# Altium schematic sheet IO and Connectors.SchDoc
size Letter; DocumentNumber: 6; SheetNumber: 6; SheetTotal: 7
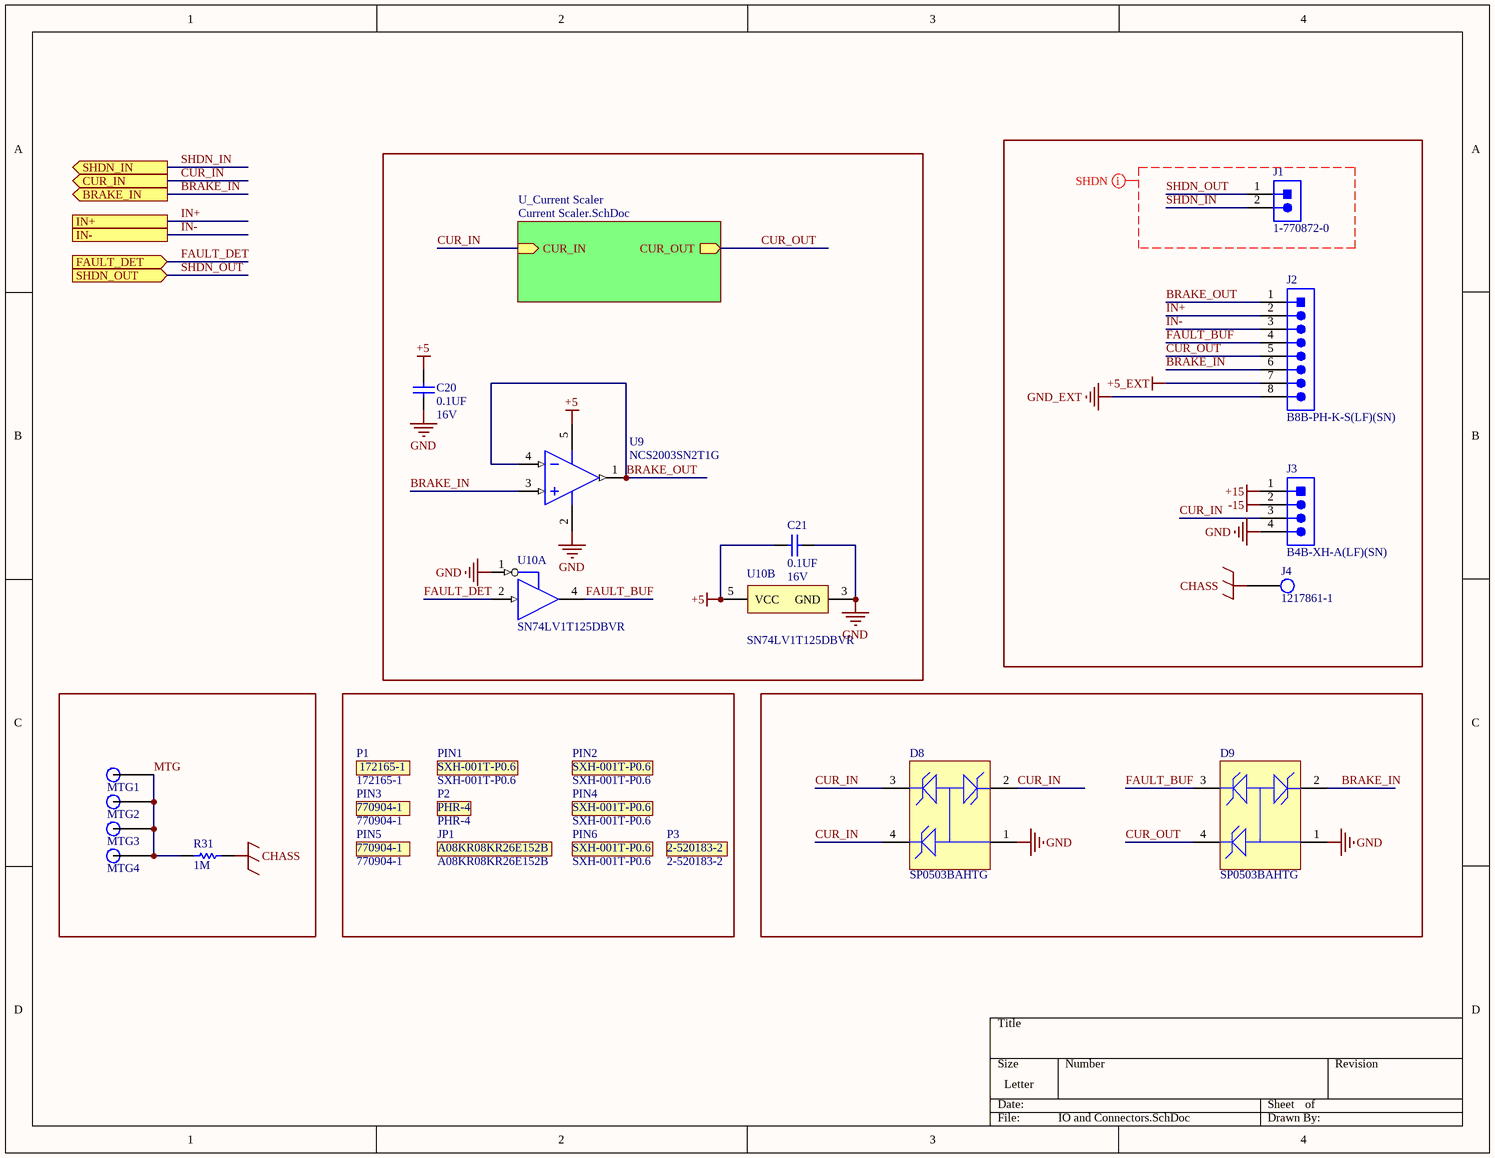
[diagram p0: IO and Connectors.SchDoc]

## Parts
C20  Val: 0.1UF  Vol: 16V  [0603_CAP]  (hidden comment: CAP 0603 0.1UF 16V 10% X7R)
C21  Val: 0.1UF  Vol: 16V  [0603_CAP]  (hidden comment: CAP 0603 0.1UF 16V 10% X7R)
D8  SP0503BAHTG  [LFUS-SOT143-4_V]
D9  SP0503BAHTG  [LFUS-SOT143-4_V]
J1  1-770872-0  [CON2_1X2_P163_VM_ALT]
J2  B8B-PH-K-S(LF)(SN)  [B8B-PH-K]
J3  B4B-XH-A(LF)(SN)  [B4B-XH-A(LF)(SN)]
J4  1217861-1  [1217861-1]
JP1  A08KR08KR26E152B  (mechanical)
MTG1  PCB MTG M3  [MTG-M3]  (value not drawn)  (no BOM)
MTG2  PCB MTG M3  [MTG-M3]  (value not drawn)  (no BOM)
MTG3  PCB MTG M3  [MTG-M3]  (value not drawn)  (no BOM)
MTG4  PCB MTG M3  [MTG-M3]  (value not drawn)  (no BOM)
P1  172165-1  (mechanical)
P2  PHR-4  (mechanical)
P3  2-520183-2  (mechanical)
PIN1  SXH-001T-P0.6  (mechanical)
PIN2  SXH-001T-P0.6  (mechanical)
PIN3  770904-1  (mechanical)
PIN4  SXH-001T-P0.6  (mechanical)
PIN5  770904-1  (mechanical)
PIN6  SXH-001T-P0.6  (mechanical)
R31  value 1M  [RESC2013X60X35ML10T20]  (hidden comment: RT0805BRE071ML)
U9  NCS2003SN2T1G  [ONSC-TSOP-5-483-02_V]
U10  SN74LV1T125DBVR  [DBV0005A_M]  (parts A,B of 2)

## Sub-sheets
U_Current Scaler = Current Scaler.SchDoc: CUR_IN (in), CUR_OUT (out)

## Ports
BRAKE_IN (out), CUR_IN (out), FAULT_DET (in), IN+, IN-, SHDN_IN (out), SHDN_OUT (in)

## Nets
+5: C20.2 C21.2 U9.5(VDD) U10.5(VCC)
+5_EXT: J2.7
+15: J3.1
-15: J3.2
CHASS: J4.1 R31.1
GND: C20.1 C21.1 D8.1 D9.1 J3.4 U9.2(VSS) U10.1(~{OE}) U10.3(GND)
GND_EXT: J2.8
BRAKE_IN: D9.2 J2.6 U9.3(IN+) ; port BRAKE_IN
BRAKE_OUT: J2.1 U9.1(VOUT) U9.4(IN-)
CUR_IN: D8.2 D8.3 D8.4 J3.3 ; port CUR_IN, sheet U_Current Scaler/CUR_IN
CUR_OUT: D9.4 J2.5 ; sheet U_Current Scaler/CUR_OUT
FAULT_BUF: D9.3 J2.4 U10.4(Y)
FAULT_DET: U10.2(A) ; port FAULT_DET
IN+: J2.2 ; port IN+
IN-: J2.3 ; port IN-
MTG: MTG1.1 MTG2.1 MTG3.1 MTG4.1 R31.2
SHDN_IN: J1.2 ; port SHDN_IN
SHDN_OUT: J1.1 ; port SHDN_OUT

## Layout directives
net class PWR; net class HC: SHDN_IN, SHDN_OUT

## Library data of the parts
C20 C21 = CAP 0603 0.1UF 16V 10% X7R: Capacitor Surface Mount 0603 Footprint 0.1UF 16V 10% Tolerance Ceramic X7R; Manufacturer: Various; PCB Package: 0603; Description in Visual: Cap SMT 0603 0.1UF 16V 10%  Cer X7R; P/N: CAP 0603 0.1UF 16V 10% X7R; Manufacturer P/N: Various; Value: 0.1UF; Voltage: 16V; Tolerance: 10%; Type: Ceramic X7R; ComponentLink1Description: Manufacturer Website; ComponentLink2Description: Component Datasheet; ComponentLink3Description: Octopart Link
D8 D9 = CMP-2000-05191-1: TVS Diode Array, 30 pF, 30 KV, -40 to 85 degC, 4-Pin SOT143, RoHS, Tape and Reel; Manufacturer: Littelfuse; Direction Type: Uni-Directional; Product Height (mm): 1.05mm; Leakage Current (Max): 0.1uA; Clamping Voltage (Max): 8V; Reverse Stand-off Voltage: 5.5(Min)V; Configuration: Triple; Working Voltage: 5.5V; Product Length (mm): 3.04mm; Working Voltage (Max): 5.5V(Min); Capacitance Value: 30pF; Rad Hardened: No; Number of Elements: 3; Product Depth (mm): 1.4mm; Operating Temperature Max Deg. C: 85C; Suppressor Type: TVS; Operating Temperature Min Deg. C: -40C; Operating Temp Range: -40Cto85C; Mounting: SurfaceMount; Package / Case: SOT-143; Datasheet Version: Dec-13; Package Type: SOT-143; Packaging: TapeandReel; Pin Count: 3+Tab; Operating Temperature Classification: Industrial; Datasheet URL: https://datasheet.ciiva.com/15143/getdatasheetpartid-116020-15143550.pdf; Manufacturer URL: http://www.littelfuse.com/; Leakage Current: 0.1uA; Mounting Style: SurfaceMount; Clamping Voltage: 8V; Polarity: Uni-Directional
J1 = 1-770872-0: Connector Header Through Hole 2 position 0.163" (4.14mm); Vendor: TE Connectivity; Built_By: EMA_UL_Team; Manufacturer_Part_Number: 1-770872-0; Copyright: Copyright (C) 2018 Accelerated Designs. All rights reserved; RefDes: RefDes; Type: DEV; Value: Value
J2 = B8B-PH-K-S(LF)(SN): Connector Header Through Hole 8 position 0.079" (2.00mm); Supplier 1: Digi-Key; Supplier Part Number 1: 455-1710-ND
J3 = B4B-XH-A(LF)(SN): Connector Header Through Hole 4 position 0.098" (2.50mm); Manufacturer: JST; No of Positions: 4; Style/Orientation: StraightHeader/Plug; Type: ShroudedHeader; Manufacturer URL: http://www.jst.com/home2.html; Termination: Crimp; Datasheet Version: Apr-09; Supplier 1: Newark; Supplier Part Number 1: 73M9436
J4 = 1217861-1: CONN TAB .250 STR QC TIN PCB; Gender: Male; Hole Diameter: 0.055inch; Insulation: Non-Insulated; Tab Length: 0.352inch; Tab Thickness: 0.032inch; Tab Width: 0.25inch; PCB Thickness: 0.062inch; Body Material: Brass; Insulated Wire Support: Yes; Contact Material: Brass; Contact Plating: Tin; ELV: Compliant; Length: 0.552inch; Material: Brass; Mount: Through Hole; Package Quantity: 2000; Packaging: Tape and Reel; Termination: Tab; Mating Tab Width: 0.25inch; Body Plating: Tin; Depth: 7.92mm; Plating: Tin; REACH SVHC: Unknown; Terminal Material: Brass; Lead Free: Lead Free; Supplier 1: Digi-Key; Supplier Part Number 1: A100452CT-ND
JP1 = A08KR08KR26E152B: 8 Position Cable Assembly Rectangular Socket to Socket 0.500' (152.40mm, 6.00"); Supplier 1: Digi-Key; Supplier Part Number 1: 455-3153-ND
MTG1-MTG4 = MTG M3: PCB Mounting for M3 Screw; P/N: MTG M3; PCB Package: M3
P1 = 172165-1: 2 Position Rectangular Housing Connector Plug Natural 0.163" (4.14mm); Supplier 1: Digi-Key; Supplier Part Number 1: A25587-ND
P2 = PHR-4: 4 Position Rectangular Housing Connector Receptacle Natural 0.079" (2.00mm); Supplier 1: Digi-Key; Supplier Part Number 1: 455-1164-ND
P3 = 2-520183-2: 0.250" (6.35mm) Quick Connect Female 18-22 AWG Crimp Connector Fully Insulated; Supplier 1: Digi-Key; Supplier Part Number 1: A27817CT-ND
PIN1 PIN2 PIN4 PIN6 = SXH-001T-P0.6: Socket Contact Tin 22-28 AWG Crimp Stamped; Supplier 1: Newark; Supplier Part Number 1: 49Y1258
PIN3 PIN5 = 770904-1: Socket Contact  Crimp 18-22 AWG Stamped; Supplier 1: Digi-Key; Supplier Part Number 1: A25684CT-ND
R31 = CMP-2001-01491-1: Manufacturer: Yageo; Part Number: RT0805BRE071ML
U9 = CMP-1310-00381-1: Low Voltage, Rail-to-Rail Output Operational Amplifier, 1.7 to 5.5 V, -40 to 85 degC, 5-Pin TSOP, Pb-Free, Tape and Reel; Manufacturer: On Semiconductor; VCC Max (V): 5.5; VCC Min (V): 1.7; ComponentLink3URL: http://www.onsemi.com/pub_link/Collateral/483.PDF; Packing: Tape and Reel; ComponentLink1URL: http://www.onsemi.com/; PackageReference: TSOP-5-483-02; Mounting Technology: Surface Mount; PackageVersion: Rev. K, 04/2013; PartNumber: NCS2003SN2T1G; DatasheetVersion: Rev. 3; ComponentLink2URL: http://www.onsemi.cn/pub_link/Collateral/NCS2003-D.PDF; ComponentLink2Description: Datasheet; ComponentLink3Description: Package Specification; RoHS: TRUE; PackageDescription: 5-Pin Small Outline Package, Body 3 x 1.5 mm, Pitch 0.95 mm; ComponentLink1Description: Manufacturer URL
U10 = CMP-0859-00122-3: Single Power Supply, Single BUFFER GATE w/ 3-State Output (active low enable), DBV0005A, LARGE T&R; Manufacturer: Texas Instruments; Schmitt Trigger: No; Sub-Family: Non-Inverting Buffer/Driver; Voltage(Nom)(V): 1.8,2.5,3.3,5.5; Output Drive (IOL/IOH)(Max)(mA): 8/-8; Bits(#): 1; Technology Family: LV1T; F @ Nom Voltage(Max)(Mhz): 50; Output Type: CMOS; Input Type: TTL; VCC(Min)(V): 1.6; tpd @ Nom Voltage(Max)(ns): 14.5,9.5,8.0,6.5; 3-State Output: Yes; ICC @ Nom Voltage(Max)(mA): 0.01; Rating: Catalog; Logic: True; Special Features: 1.8V to 3.3V Up Translation,3.3V to 1.8V Down Translation,5V Input Tolerant; VCC(Max)(V): 5.5; PackageReference: DBV0005A; Generic Part Number: SN74LV1T125; Operating Temperature Range(C): -40 to 125; DatasheetVersion: SCLS745A